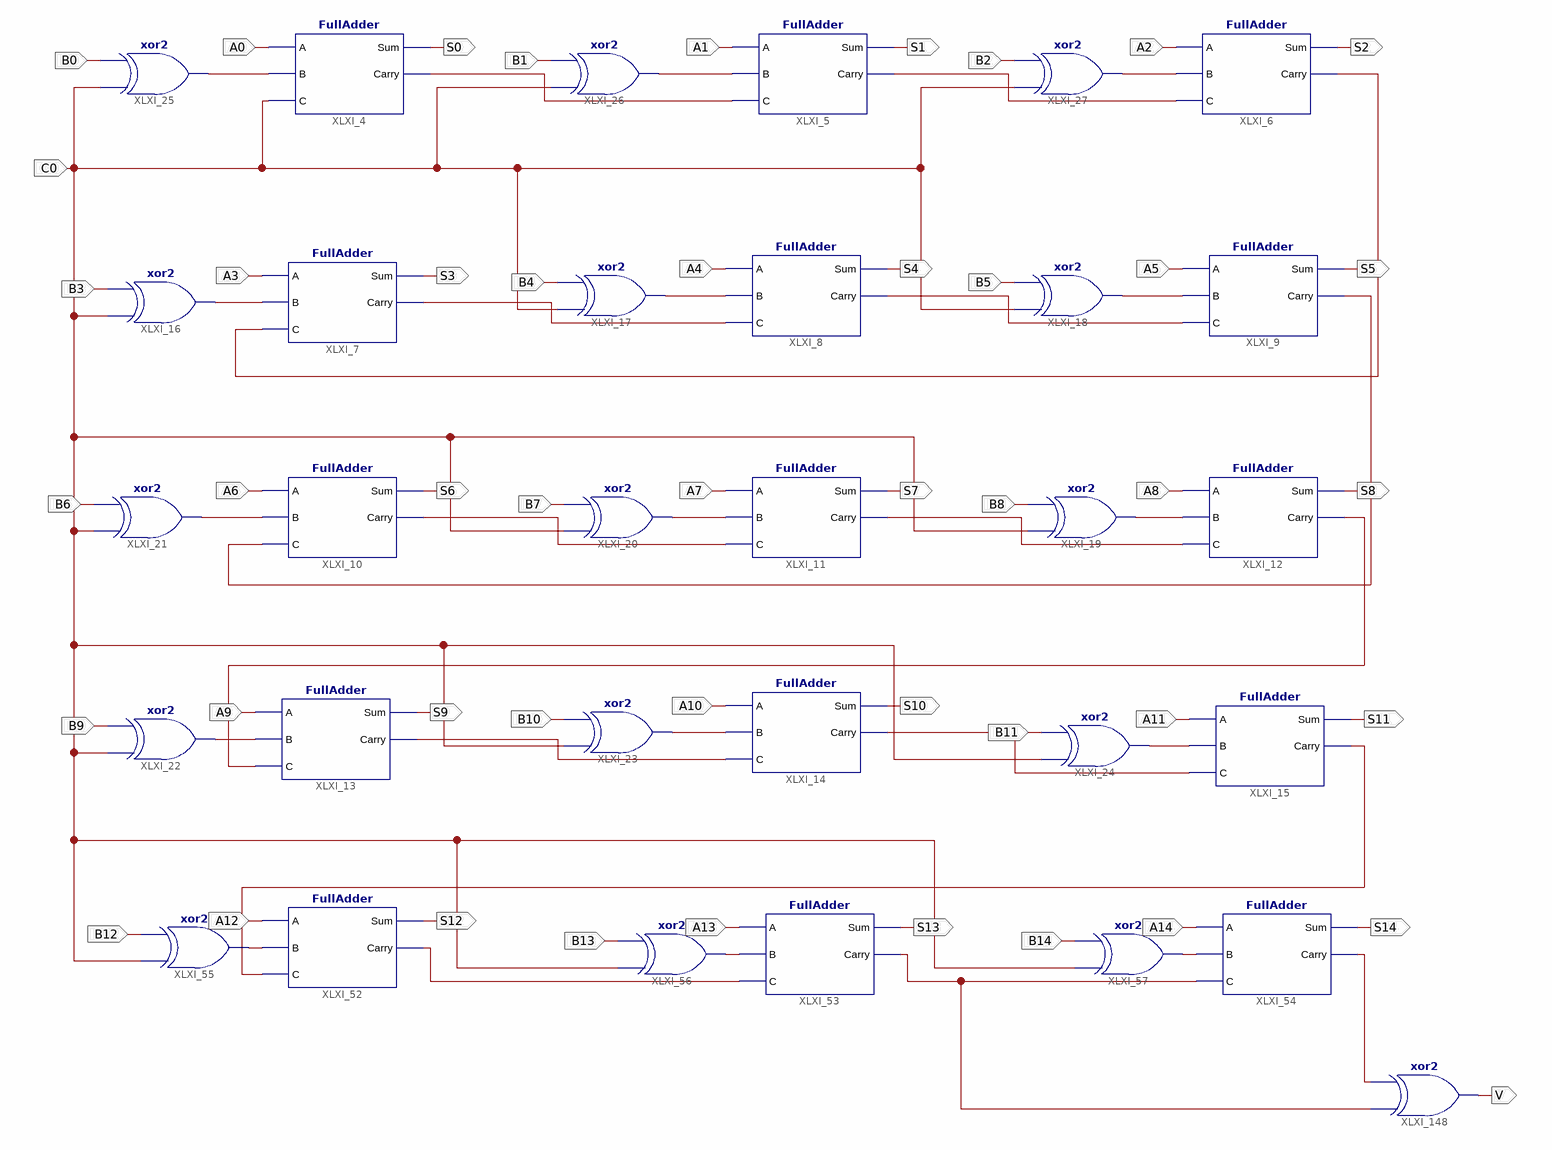
[diagram p0: schematic sheet 1]
// Xilinx ISE schematic CarryRippleFullAdderSubtractor15Bits.sch (spartan3e) as structural Verilog: 31 symbols, 47 ports
module CarryRippleFullAdderSubtractor15Bits (
  input  A0,
  input  A1,
  input  C0,
  input  B1,
  input  B2,
  input  A2,
  input  A3,
  input  B4,
  input  A4,
  input  B5,
  input  A5,
  input  B6,
  input  A6,
  input  B7,
  input  A7,
  input  A8,
  input  B9,
  input  A9,
  input  B10,
  input  A10,
  input  A11,
  input  B0,
  input  B3,
  input  B11,
  input  B8,
  input  B12,
  input  A12,
  input  B13,
  input  A13,
  input  B14,
  input  A14,
  output S0,
  output S1,
  output S2,
  output S3,
  output S4,
  output S5,
  output S6,
  output S7,
  output S8,
  output S9,
  output S10,
  output S11,
  output S12,
  output S13,
  output S14,
  output V
);

  wire XLXN_1, XLXN_2, XLXN_3, XLXN_4, XLXN_5, XLXN_6, XLXN_7, XLXN_8, XLXN_9, XLXN_10, XLXN_11, XLXN_12,
       XLXN_31, XLXN_32, XLXN_33, XLXN_37, XLXN_38, XLXN_39, XLXN_42, XLXN_43, XLXN_44, XLXN_45, XLXN_46,
       XLXN_84, XLXN_90, XLXN_91, XLXN_92, XLXN_93, XLXN_347, XLXN_348;

  FullAdder XLXI_4 (.A(A0), .B(XLXN_10), .C(C0), .Carry(XLXN_31), .Sum(S0));
  FullAdder XLXI_5 (.A(A1), .B(XLXN_11), .C(XLXN_31), .Carry(XLXN_32), .Sum(S1));
  FullAdder XLXI_6 (.A(A2), .B(XLXN_12), .C(XLXN_32), .Carry(XLXN_33), .Sum(S2));
  FullAdder XLXI_7 (.A(A3), .B(XLXN_1), .C(XLXN_33), .Carry(XLXN_37), .Sum(S3));
  FullAdder XLXI_8 (.A(A4), .B(XLXN_2), .C(XLXN_37), .Carry(XLXN_38), .Sum(S4));
  FullAdder XLXI_9 (.A(A5), .B(XLXN_3), .C(XLXN_38), .Carry(XLXN_39), .Sum(S5));
  FullAdder XLXI_10 (.A(A6), .B(XLXN_6), .C(XLXN_39), .Carry(XLXN_42), .Sum(S6));
  FullAdder XLXI_11 (.A(A7), .B(XLXN_5), .C(XLXN_42), .Carry(XLXN_43), .Sum(S7));
  FullAdder XLXI_12 (.A(A8), .B(XLXN_4), .C(XLXN_43), .Carry(XLXN_44), .Sum(S8));
  FullAdder XLXI_13 (.A(A9), .B(XLXN_7), .C(XLXN_44), .Carry(XLXN_46), .Sum(S9));
  FullAdder XLXI_14 (.A(A10), .B(XLXN_8), .C(XLXN_46), .Carry(XLXN_45), .Sum(S10));
  FullAdder XLXI_15 (.A(A11), .B(XLXN_9), .C(XLXN_45), .Carry(XLXN_90), .Sum(S11));
  xor XLXI_26 (XLXN_11, C0, B1);
  xor XLXI_27 (XLXN_12, C0, B2);
  xor XLXI_18 (XLXN_3, C0, B5);
  xor XLXI_19 (XLXN_4, C0, B8);
  xor XLXI_17 (XLXN_2, C0, B4);
  xor XLXI_20 (XLXN_5, C0, B7);
  xor XLXI_21 (XLXN_6, C0, B6);
  xor XLXI_22 (XLXN_7, C0, B9);
  xor XLXI_23 (XLXN_8, C0, B10);
  xor XLXI_25 (XLXN_10, C0, B0);
  xor XLXI_16 (XLXN_1, C0, B3);
  xor XLXI_24 (XLXN_9, C0, B11);
  FullAdder XLXI_52 (.A(A12), .B(XLXN_91), .C(XLXN_90), .Carry(XLXN_84), .Sum(S12));
  FullAdder XLXI_53 (.A(A13), .B(XLXN_92), .C(XLXN_84), .Carry(XLXN_347), .Sum(S13));
  FullAdder XLXI_54 (.A(A14), .B(XLXN_93), .C(XLXN_347), .Carry(XLXN_348), .Sum(S14));
  xor XLXI_55 (XLXN_91, C0, B12);
  xor XLXI_56 (XLXN_92, C0, B13);
  xor XLXI_57 (XLXN_93, C0, B14);
  xor XLXI_148 (V, XLXN_347, XLXN_348);
endmodule
